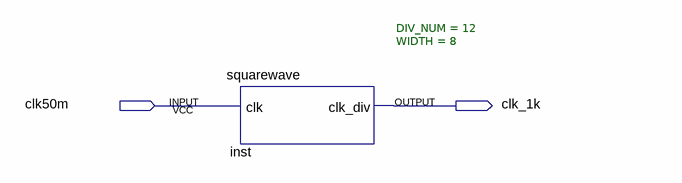
[diagram p0: schematic sheet]
// Quartus schematic Block1.bdf as structural Verilog: 1 symbols, 2 pins
module Block1 (
  input  clk50m,
  output clk_1k
);

  squarewave #(.DIV_NUM(12), .WIDTH(8)) inst (.clk(clk50m), .clk_div(clk_1k));
endmodule
